# EAGLE design dhunter_ispHeader (EAGLE 6.4)
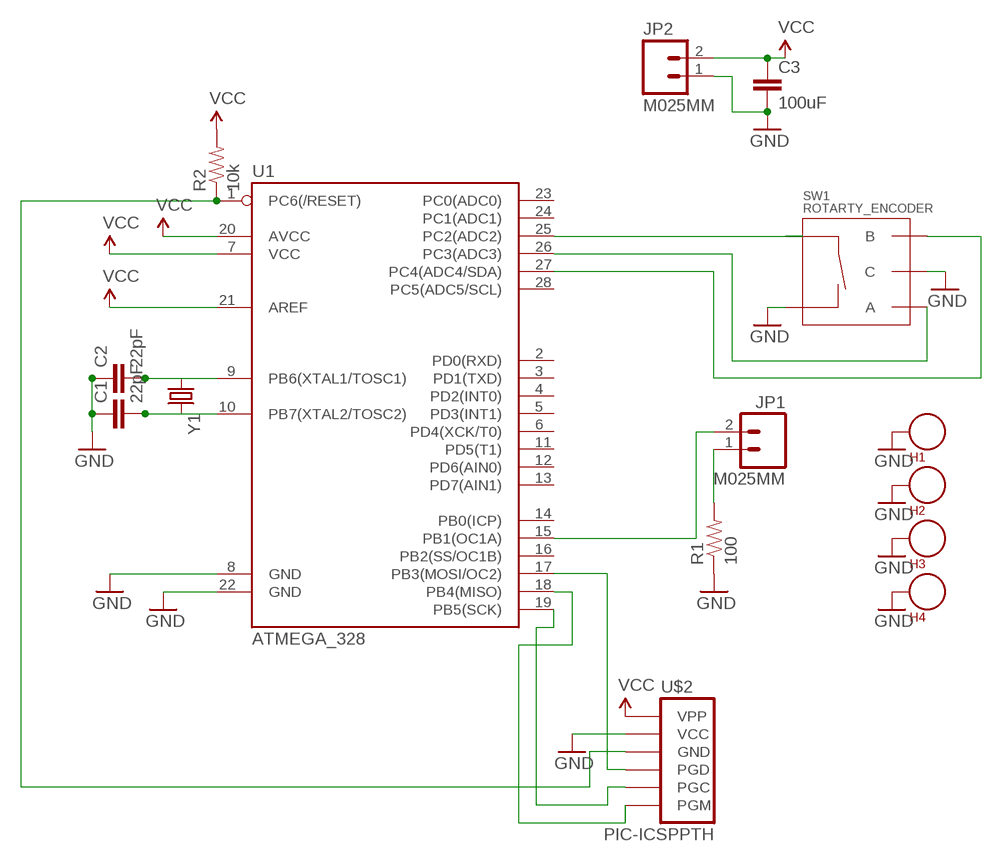
[diagram p0: schematic, sheet 1]

## Parts
C1  22pF  CAPEZ  [CAP-PTH-SMALLEZ]
C2  22pF  CAPEZ  [CAP-PTH-SMALLEZ]
C3  100uF  CAPEZ  [CAP-PTH-SMALLEZ]
H1  SEW_HOLE  [SIMPLE_HOLE]
H2  SEW_HOLE  [SIMPLE_HOLE]
H3  SEW_HOLE  [SIMPLE_HOLE]
H4  SEW_HOLE  [SIMPLE_HOLE]
JP1  M025MM  [SCREWTERMINAL-5MM-2]
JP2  M025MM  [SCREWTERMINAL-5MM-2]
R1  100  RESISTOREZ  [AXIAL-0.3EZ]
R2  10k  RESISTOREZ  [AXIAL-0.3EZ]
SW1  ROTARTY_ENCODER  [ROTARY_ENC_PLAIN]
U1  ATMEGA_328  ATMEGA328P_PDIP  [DIL28-3]
U$2  PIC-ICSPPTH  [MOLEX-1X6]
Y1  CRYSTALHC49US  [HC49US]

## Nets
GND: C1.1 C2.1 C3.2 H1.P$1 H2.P$1 H3.P$1 H4.P$1 JP2.1 R1.P$1 SW1.C SW1.SW- U1.8(GND) U1.22(GND) U$2.5(VCC)
N$2: SW1.SW+ U1.25(PC2(ADC2))
N$3: U1.17(PB3(MOSI/OC2)) U$2.3(PGD)
N$4: U1.19(PB5(SCK)) U$2.2(PGC)
N$5: C1.2 U1.10(PB7(XTAL2/TOSC2)) Y1.2
N$6: C2.2 U1.9(PB6(XTAL1/TOSC1)) Y1.1
N$7: JP1.2 U1.15(PB1(OC1A))
N$8: JP1.1 R1.P$2
N$9: R2.P$1 U1.1(PC6(/RESET)) U$2.4(GND)
N$10: U1.18(PB4(MISO)) U$2.1(PGM)
ROTA: SW1.A U1.26(PC3(ADC3))
ROTB: SW1.B U1.27(PC4(ADC4/SDA))
VCC: C3.1 JP2.2 R2.P$2 U1.7(VCC) U1.20(AVCC) U1.21(AREF) U$2.6(VPP)
Unconnected: U1.2(PD0(RXD)) U1.3(PD1(TXD)) U1.4(PD2(INT0)) U1.5(PD3(INT1)) U1.6(PD4(XCK/T0)) U1.11(PD5(T1)) U1.12(PD6(AIN0)) U1.13(PD7(AIN1)) U1.14(PB0(ICP)) U1.16(PB2(SS/OC1B)) U1.23(PC0(ADC0)) U1.24(PC1(ADC1)) U1.28(PC5(ADC5/SCL))

## Library data of the parts
C1-C3 = SparkFun-Capacitors:CAP: Capacitor Standard 0603 ceramic capacitor, and 0.1" leaded capacitor.
H1-H4 = LilyPad-Wearables:SEW_HOLE: Simple sew-hole .1" diameter hole with 20mil annular ring
JP1 JP2 = SparkFun-Connectors:M02: Standard 2-pin 0.1" header. Use with - straight break away headers ( PRT-00116) - right angle break away headers (PRT-00553) - swiss pins (PRT-00743) - machine pins (PRT-00117) - female headers (PRT-00115) Molex polarized connector foot print use with: PRT-08233 with associated crimp pins and housings. 2.54_SCREWTERM for use with PRT-10571. 3.5mm Screw Terminal footprints for PRT-08084 5mm Screw Terminal footprints for use with PRT-08433
R1 R2 = SparkFun-Passives:RESISTOR: Resistor Basic schematic elements and footprints for 0603, 1206, and PTH resistors.
SW1 = SparkFun-Electromechanical:ROTARTY_ENCODER: Simple no LED rotary encoder Example: COM-09117
U1 = SparkFun-DigitalIC:ATMEGA328P_PDIP: uC used in the Arduino 32kb flash, 1k EEPROM, 2k SRAM This is the through-hole version of this chip.
U$2 = SparkFun-Connectors:PIC-ICSP: ISCP Programming connector for UAV, UBW Kit, etc.
Y1 = SparkFun-FreqCtrl:CRYSTAL: Various standard crystals. Proven footprints. Spark Fun Electronics SKU : COM-00534

## Board
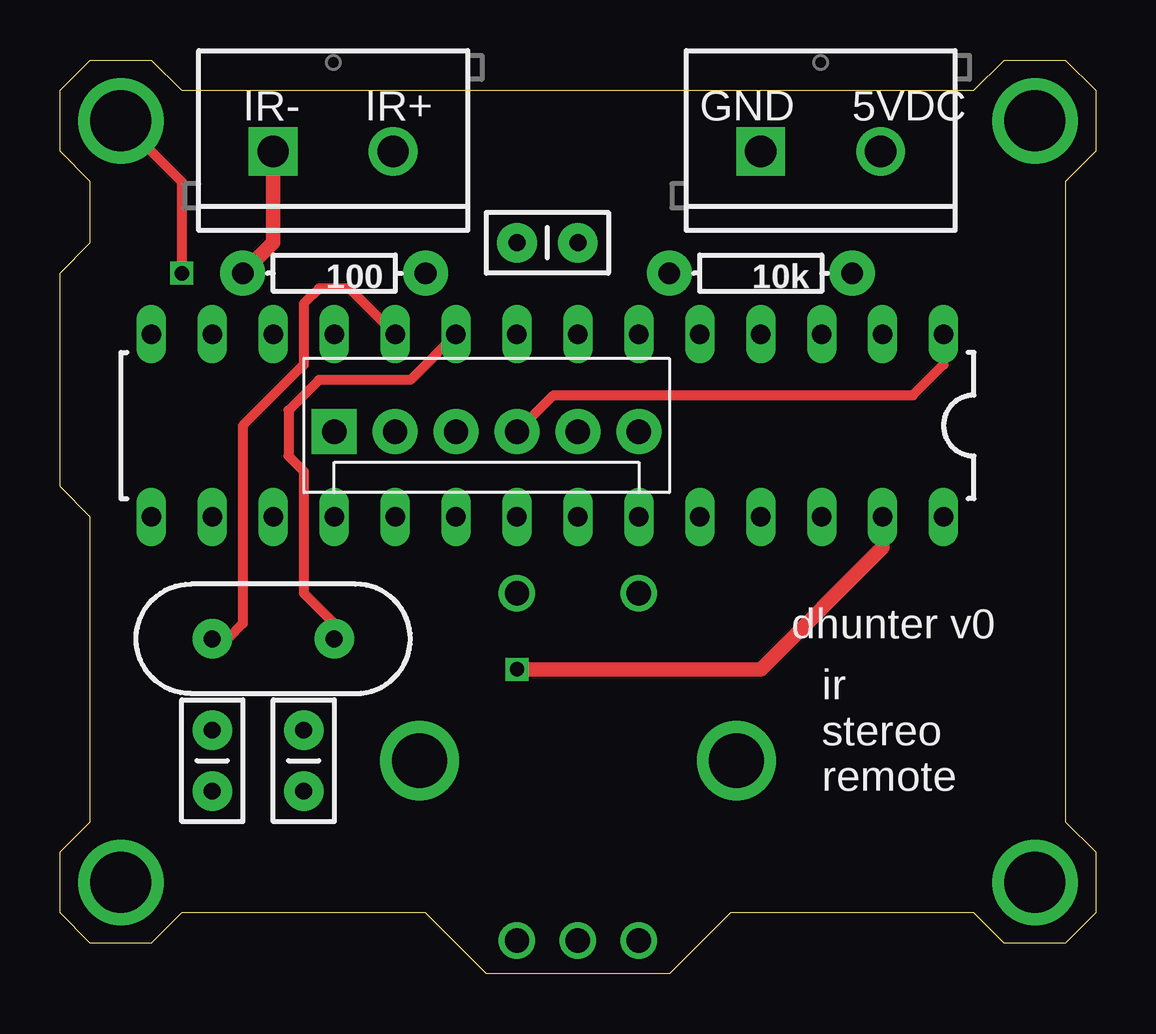
[diagram p1: board, top side]
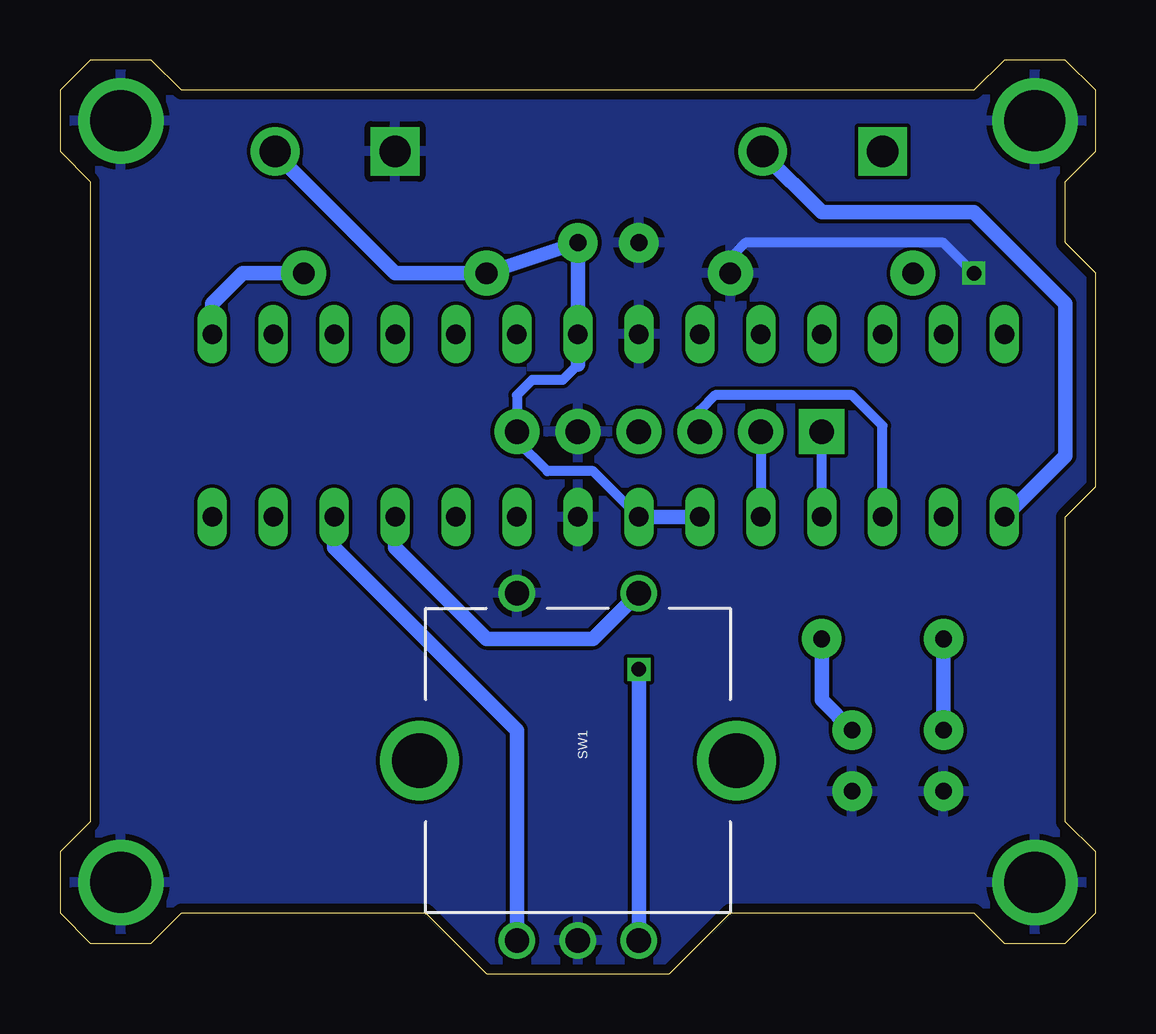
[diagram p2: board, bottom side, seen from below]

Size 43.18 x 38.1 mm. Coordinates in mm from the lower left corner, seen from the top.
Outline: 0,36.83 1.27,38.1 3.81,38.1 5.08,36.83 38.1,36.83 39.37,38.1 41.91,38.1 43.18,36.83 43.18,34.29 41.91,33.02 41.91,6.35 43.18,5.08 43.18,2.54 41.91,1.27 39.37,1.27 38.1,2.54 27.94,2.54 25.4,0 17.78,0 15.24,2.54 5.08,2.54 3.81,1.27 1.27,1.27 0,2.54 0,5.08 1.27,6.35 1.27,19.05 0,20.32 0,29.21 1.27,30.48 1.27,33.02 0,34.29 0,36.83
Copper layers (1*16): Top 0.0356mm / dielectric 1.5011mm / Bottom 0.0356mm
Design rules "LaenPCBOrder": minimum track width 6mil, minimum drill 13mil, track to track 6mil, track to pad 6mil, pad to pad 6mil, via to via 6mil, smd to smd 6mil, copper to edge 15mil, drill to drill 6mil, minimum pad ring 7mil, minimum via ring 7mil, stop-mask expansion 4mil, vias tented up to drill 0mil, thermal gap 10mil

### Footprints (pad centres in the part's own frame; a part is rotated, then mirrored left to right if it is on the bottom)
CAP-PTH-SMALLEZ = drill 0.7 pad 1.651: 1 0,0; 2 2.54,0
SIMPLE_HOLE = drill 2.54 pad 3.048: P$1 0,0
SCREWTERMINAL-5MM-2 = drill 1.3 pad 2.032 square: 1 0,0 | drill 1.3 pad 2.032: 2 5,0
AXIAL-0.3EZ = drill 0.9 pad 1.88: P$1 -3.81,0; P$2 3.81,0
ROTARY_ENC_PLAIN = drill 1.016: A 7.493,-2.54; B 7.493,2.54; C 7.493,0; SW+ -6.985,2.54; SW- -6.985,-2.54 | drill 2.286: P$3 0,6.604; P$4 0,-6.604
DIL28-3 = drill 0.813 long: 1 -16.51,-3.81; 2 -13.97,-3.81; 3 -11.43,-3.81; 4 -8.89,-3.81; 5 -6.35,-3.81; 6 -3.81,-3.81; 7 -1.27,-3.81; 8 1.27,-3.81; 9 3.81,-3.81; 10 6.35,-3.81; 11 8.89,-3.81; 12 11.43,-3.81; 13 13.97,-3.81; 14 16.51,-3.81; 15 16.51,3.81; 16 13.97,3.81; 17 11.43,3.81; 18 8.89,3.81; 19 6.35,3.81; 20 3.81,3.81; 21 1.27,3.81; 22 -1.27,3.81; 23 -3.81,3.81; 24 -6.35,3.81; 25 -8.89,3.81; 26 -11.43,3.81; 27 -13.97,3.81; 28 -16.51,3.81
MOLEX-1X6 = drill 1.016 pad 1.88 square: 1 0,0 | drill 1.016 pad 1.88: 2 2.54,0; 3 5.08,0; 4 7.62,0; 5 10.16,0; 6 12.7,0
HC49US = drill 0.7 pad 1.651: 1 -2.54,0; 2 2.54,0

### Placement (x,y rotation side)
C1  6.35,7.62 90 top
C2  10.16,7.62 90 top
C3  21.59,30.48 180 top
H1  2.54,3.81 0 top
H2  2.54,35.56 0 top
H3  40.64,3.81 0 top
H4  40.64,35.56 0 top
JP1  8.89,34.29 0 top
JP2  29.21,34.29 0 top
R1  11.43,29.21 180 top
R2  29.21,29.21 180 top
SW1  21.59,8.89 270 bottom
U1  20.32,22.86 180 top
U$2  11.43,22.61 0 top
Y1  8.89,13.97 180 top

### Tracks (layer width: path | path; a pad name or v marks a point on that pad's centre or on a via)
GND  (via drill 0.6)
  Top 0.406: H2.P$1 5.08,33.02 v5.08,29.21
  Bottom 0.406: v5.08,29.21 6.35,30.48 14.6,30.48 15.24,29.84 R1.P$1
  pour Bottom: 0,38.1 0,0 43.18,0 43.18,38.1
N$2
  Bottom 0.61: U1.25 29.21,17.78 25.4,13.97 20.96,13.97 SW1.SW+
N$3
  Bottom 0.406: U1.17 8.89,22.86 10.16,24.13 15.87,24.13 16.51,23.5 U$2.3
N$4
  Bottom 0.406: U$2.2 U1.19
N$5
  Top 0.406: U1.10 12.06,28.57 10.79,28.57 10.16,27.94 10.16,25.4 7.62,22.86 7.62,14.61 6.98,13.97 Y1.2
  Bottom 0.61: C1.2 Y1.2
N$6
  Top 0.406: U1.9 14.6,24.77 10.79,24.77 9.53,23.5 9.53,21.59 10.16,20.96 10.16,15.88 11.43,14.61 Y1.1
  Bottom 0.61: C2.2 11.43,11.43 Y1.1
N$7
  Bottom 0.61: JP1.2 13.89,34.21 11.43,31.75 5.08,31.75 1.27,27.94 1.27,21.59 U1.15
N$8
  Top 0.61: JP1.1 8.89,30.48 R1.P$2
N$9
  Top 0.406: U$2.4 20.57,24.13 35.56,24.13 36.83,25.4 U1.1
  Bottom 0.61: R2.P$1 35.56,29.21 36.83,27.94 U1.1
N$10
  Bottom 0.406: U1.18 U$2.1
ROTA
  Bottom 0.61: SW1.A 24.13,10.16 31.75,17.78 U1.26
ROTB  (via drill 0.6)
  Top 0.61: v19.05,12.7 29.21,12.7 34.29,17.78 U1.27
  Bottom 0.61: SW1.B v19.05,12.7
VCC
  Bottom 0.406: 21.59,25.4 22.23,24.77 23.5,24.77 24.13,24.13 U$2.6 24.13,22.23 22.86,20.96 20.96,20.96 U1.21
  Bottom 0.61: 21.59,25.4 U1.7 C3.1 R2.P$2 29.21,29.21 34.21,34.21 JP2.2 | U1.21 U1.20

### Text on the board
tNames: IR- | IR+ | GND | 5VDC | dhunter v0 | ir / stereo / remote